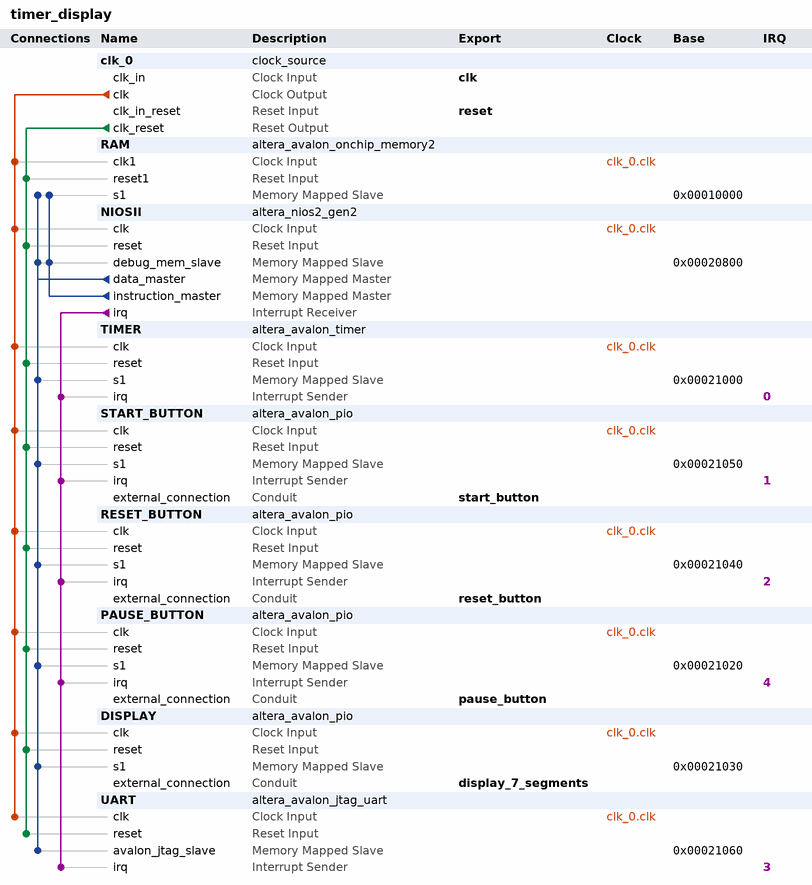
[diagram p0: system contents]
# Platform Designer (Qsys) system timer_display, Cyclone V 5CSEMA5F31C6
# Parameters at their usual value, and those the tool derives, are not listed.
package require -exact qsys 18.1
create_system timer_display
set_project_property DEVICE_FAMILY {Cyclone V}
set_project_property DEVICE 5CSEMA5F31C6

add_instance clk_0 clock_source 18.1
set_instance_parameter_value clk_0 clockFrequency 50000000

add_instance RAM altera_avalon_onchip_memory2 18.1
set_instance_parameter_value RAM dataWidth 32
set_instance_parameter_value RAM dualPort false
set_instance_parameter_value RAM initMemContent true
set_instance_parameter_value RAM initializationFileName onchip_mem.hex
set_instance_parameter_value RAM memorySize 65536

add_instance NIOSII altera_nios2_gen2 18.1
set_instance_parameter_value NIOSII dcache_size 2048
set_instance_parameter_value NIOSII exceptionSlave RAM.s1
set_instance_parameter_value NIOSII icache_size 4096
set_instance_parameter_value NIOSII impl Tiny
set_instance_parameter_value NIOSII resetSlave RAM.s1

add_instance TIMER altera_avalon_timer 18.1
set_instance_parameter_value TIMER fixedPeriod true
set_instance_parameter_value TIMER period 1
set_instance_parameter_value TIMER periodUnits SEC

add_instance START_BUTTON altera_avalon_pio 18.1
set_instance_parameter_value START_BUTTON bitClearingEdgeCapReg true
set_instance_parameter_value START_BUTTON captureEdge true
set_instance_parameter_value START_BUTTON direction Input
set_instance_parameter_value START_BUTTON edgeType FALLING
set_instance_parameter_value START_BUTTON generateIRQ true
set_instance_parameter_value START_BUTTON irqType EDGE
set_instance_parameter_value START_BUTTON simDoTestBenchWiring true
set_instance_parameter_value START_BUTTON width 1

add_instance RESET_BUTTON altera_avalon_pio 18.1
set_instance_parameter_value RESET_BUTTON bitClearingEdgeCapReg true
set_instance_parameter_value RESET_BUTTON captureEdge true
set_instance_parameter_value RESET_BUTTON direction Input
set_instance_parameter_value RESET_BUTTON edgeType FALLING
set_instance_parameter_value RESET_BUTTON generateIRQ true
set_instance_parameter_value RESET_BUTTON irqType EDGE
set_instance_parameter_value RESET_BUTTON simDoTestBenchWiring true
set_instance_parameter_value RESET_BUTTON width 1

add_instance PAUSE_BUTTON altera_avalon_pio 18.1
set_instance_parameter_value PAUSE_BUTTON bitClearingEdgeCapReg true
set_instance_parameter_value PAUSE_BUTTON captureEdge true
set_instance_parameter_value PAUSE_BUTTON direction Input
set_instance_parameter_value PAUSE_BUTTON edgeType FALLING
set_instance_parameter_value PAUSE_BUTTON generateIRQ true
set_instance_parameter_value PAUSE_BUTTON irqType EDGE
set_instance_parameter_value PAUSE_BUTTON simDoTestBenchWiring true
set_instance_parameter_value PAUSE_BUTTON width 1

add_instance DISPLAY altera_avalon_pio 18.1
set_instance_parameter_value DISPLAY direction Output
set_instance_parameter_value DISPLAY width 28

add_instance UART altera_avalon_jtag_uart 18.1
set_instance_parameter_value UART simInteractiveOptions NO_INTERACTIVE_WINDOWS

# connections
add_connection clk_0.clk DISPLAY.clk clock
add_connection clk_0.clk NIOSII.clk clock
add_connection clk_0.clk PAUSE_BUTTON.clk clock
add_connection clk_0.clk RAM.clk1 clock
add_connection clk_0.clk RESET_BUTTON.clk clock
add_connection clk_0.clk START_BUTTON.clk clock
add_connection clk_0.clk TIMER.clk clock
add_connection clk_0.clk UART.clk clock
add_connection clk_0.clk_reset DISPLAY.reset reset
add_connection clk_0.clk_reset NIOSII.reset reset
add_connection clk_0.clk_reset PAUSE_BUTTON.reset reset
add_connection clk_0.clk_reset RAM.reset1 reset
add_connection clk_0.clk_reset RESET_BUTTON.reset reset
add_connection clk_0.clk_reset START_BUTTON.reset reset
add_connection clk_0.clk_reset TIMER.reset reset
add_connection clk_0.clk_reset UART.reset reset
add_connection NIOSII.data_master DISPLAY.s1 avalon
set_connection_parameter_value NIOSII.data_master/DISPLAY.s1 baseAddress 0x00021030
add_connection NIOSII.data_master NIOSII.debug_mem_slave avalon
set_connection_parameter_value NIOSII.data_master/NIOSII.debug_mem_slave baseAddress 0x00020800
add_connection NIOSII.data_master PAUSE_BUTTON.s1 avalon
set_connection_parameter_value NIOSII.data_master/PAUSE_BUTTON.s1 baseAddress 0x00021020
add_connection NIOSII.data_master RAM.s1 avalon
set_connection_parameter_value NIOSII.data_master/RAM.s1 baseAddress 0x00010000
add_connection NIOSII.data_master RESET_BUTTON.s1 avalon
set_connection_parameter_value NIOSII.data_master/RESET_BUTTON.s1 baseAddress 0x00021040
add_connection NIOSII.data_master START_BUTTON.s1 avalon
set_connection_parameter_value NIOSII.data_master/START_BUTTON.s1 baseAddress 0x00021050
add_connection NIOSII.data_master TIMER.s1 avalon
set_connection_parameter_value NIOSII.data_master/TIMER.s1 baseAddress 0x00021000
add_connection NIOSII.data_master UART.avalon_jtag_slave avalon
set_connection_parameter_value NIOSII.data_master/UART.avalon_jtag_slave baseAddress 0x00021060
add_connection NIOSII.instruction_master NIOSII.debug_mem_slave avalon
set_connection_parameter_value NIOSII.instruction_master/NIOSII.debug_mem_slave baseAddress 0x00020800
add_connection NIOSII.instruction_master RAM.s1 avalon
set_connection_parameter_value NIOSII.instruction_master/RAM.s1 baseAddress 0x00010000
add_connection NIOSII.irq PAUSE_BUTTON.irq interrupt
set_connection_parameter_value NIOSII.irq/PAUSE_BUTTON.irq irqNumber 4
add_connection NIOSII.irq RESET_BUTTON.irq interrupt
set_connection_parameter_value NIOSII.irq/RESET_BUTTON.irq irqNumber 2
add_connection NIOSII.irq START_BUTTON.irq interrupt
set_connection_parameter_value NIOSII.irq/START_BUTTON.irq irqNumber 1
add_connection NIOSII.irq TIMER.irq interrupt
set_connection_parameter_value NIOSII.irq/TIMER.irq irqNumber 0
add_connection NIOSII.irq UART.irq interrupt
set_connection_parameter_value NIOSII.irq/UART.irq irqNumber 3

# exported interfaces
add_interface clk clock sink
set_interface_property clk EXPORT_OF clk_0.clk_in
add_interface display_7_segments conduit end
set_interface_property display_7_segments EXPORT_OF DISPLAY.external_connection
add_interface pause_button conduit end
set_interface_property pause_button EXPORT_OF PAUSE_BUTTON.external_connection
add_interface reset reset sink
set_interface_property reset EXPORT_OF clk_0.clk_in_reset
add_interface reset_button conduit end
set_interface_property reset_button EXPORT_OF RESET_BUTTON.external_connection
add_interface start_button conduit end
set_interface_property start_button EXPORT_OF START_BUTTON.external_connection

set_interconnect_requirement {$system} qsys_mm.clockCrossingAdapter HANDSHAKE
set_interconnect_requirement {$system} qsys_mm.enableEccProtection FALSE
set_interconnect_requirement {$system} qsys_mm.insertDefaultSlave FALSE
set_interconnect_requirement {$system} qsys_mm.maxAdditionalLatency 1

save_system timer_display.qsys
